# Altium project Power Section.PrjPcb
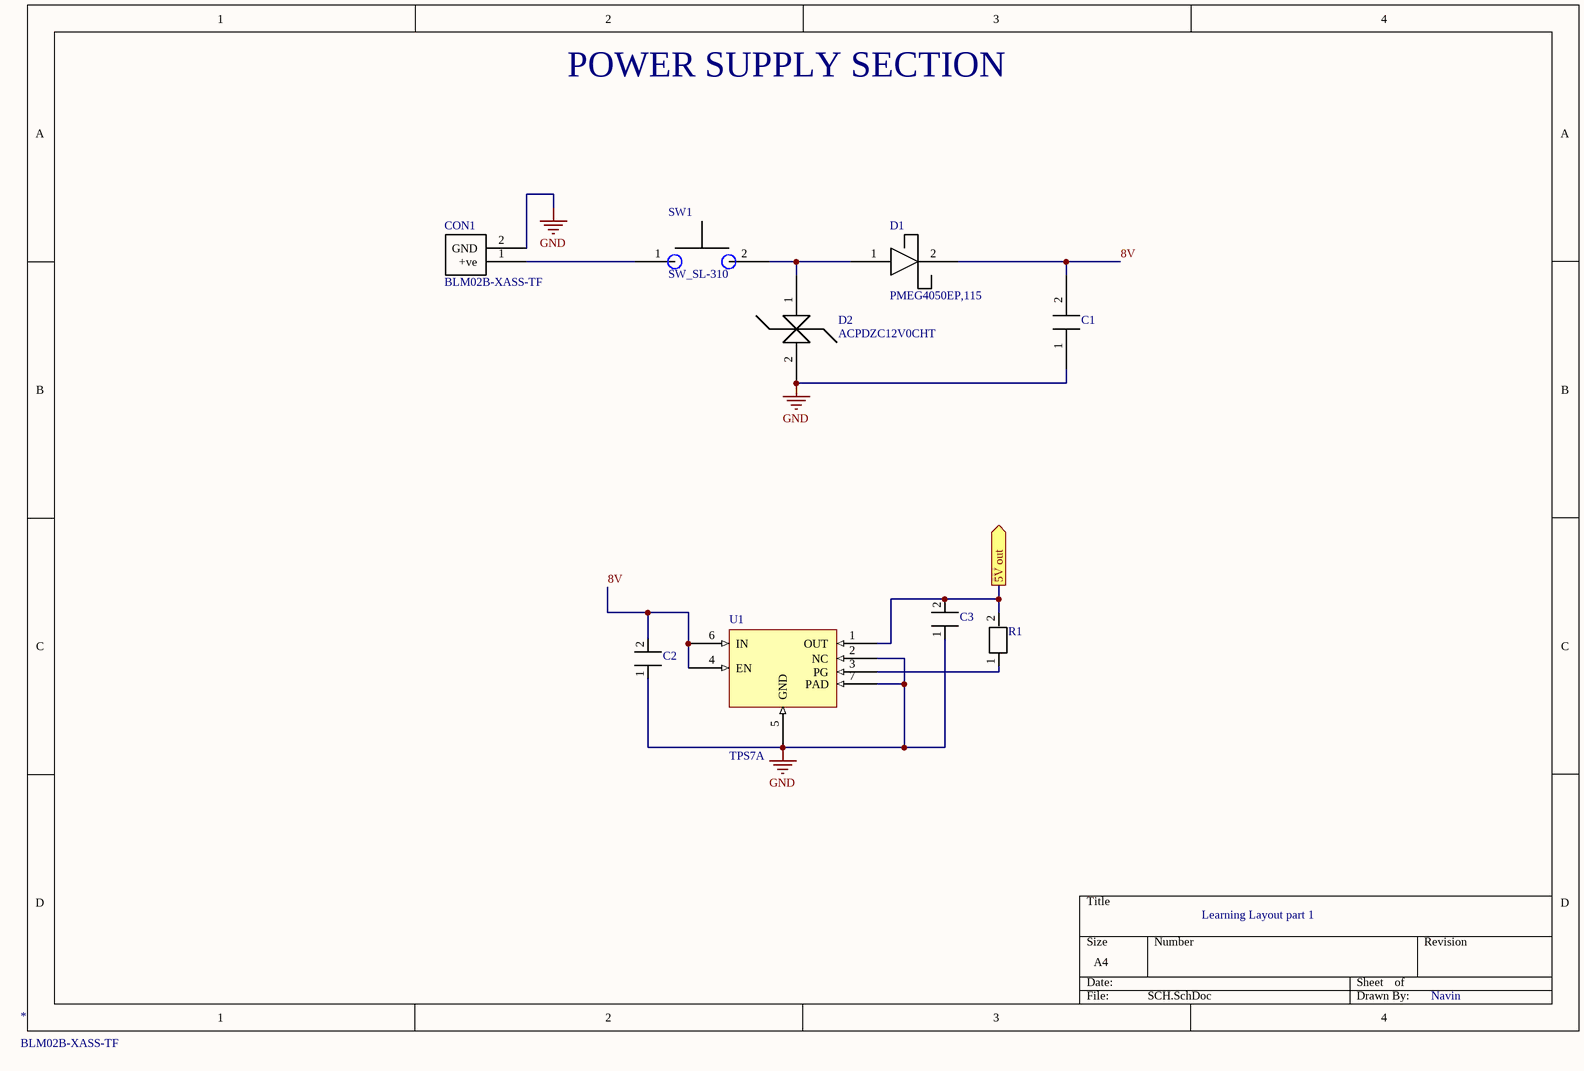
[diagram p0: SCH.SchDoc]
1 sheet, 10 parts. Net scope: flat (ports and power ports of the same name join across sheets).
Board file: PCB1.PcbDoc

## Sheet SCH.SchDoc
size A4; SheetNumber: 1; SheetTotal: 1

### Parts
*  BLM02B-XASS-TF
C1  (no value)  [3.3F super cap]
C2  (no value)  [3.3F super cap]
C3  (no value)  [3.3F super cap]
CON1  BLM02B-XASS-TF  [BM02B-XASS-TF]
D1  PMEG4050EP,115  [PMEG4050 Schottky]
D2  ACPDZC12V0CHT  [ACPDZC TVS diode]
R1  (no value)
SW1  SW_SL-310  [SW_SL-310]
U1  TPS7A  [TPS7A]

### Ports
5V out (out)

### Nets
GND: C1.1 C2.1 C3.1 CON1.2(GND) D2.2 U1.2(NC) U1.5(GND) U1.7(PAD)
8V: C1.2 C2.2 D1.2 U1.4(EN) U1.6(IN)
NetC3_2: C3.2 R1.2 U1.1(OUT) ; port 5V out
NetCON1_1: CON1.1(+ve) SW1.1
NetD1_1: D1.1 D2.1 SW1.2
NetR1_1: R1.1 U1.3(PG)

### Notes on the sheet
- POWER SUPPLY SECTION
- Learning Layout part 1
- Navin

### Library data of the parts
C1 = 3.3F super cap
C2 C3 = Capacitor
R1 = Resistor